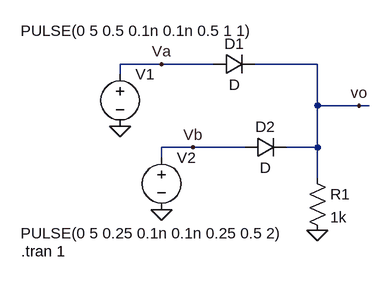
[diagram p0: schematic Draft17.asc]
Draft17.asc, the LTspice schematic file:
Version 4
SHEET 1 880 680
WIRE 144 64 80 64
WIRE 224 64 144 64
WIRE 384 64 288 64
WIRE 80 80 80 64
WIRE 384 128 384 64
WIRE 448 128 384 128
WIRE 464 128 448 128
WIRE 192 192 144 192
WIRE 272 192 192 192
WIRE 384 192 384 128
WIRE 384 192 336 192
WIRE 144 208 144 192
WIRE 384 240 384 192
FLAG 80 160 0
FLAG 144 288 0
FLAG 448 128 vo
FLAG 384 320 0
FLAG 144 64 Va
FLAG 192 192 Vb
SYMBOL voltage 80 64 R0
WINDOW 3 -153 -51 Left 2
WINDOW 123 0 0 Left 0
WINDOW 39 0 0 Left 0
SYMATTR InstName V1
SYMATTR Value PULSE(0 5 0.5 0.1n 0.1n 0.5 1 1)
SYMBOL voltage 144 192 R0
WINDOW 3 -217 132 Left 2
WINDOW 123 0 0 Left 0
WINDOW 39 0 0 Left 0
SYMATTR InstName V2
SYMATTR Value PULSE(0 5 0.25 0.1n 0.1n 0.25 0.5 2)
SYMBOL diode 224 80 R270
WINDOW 0 32 32 VTop 2
WINDOW 3 0 32 VBottom 2
SYMATTR InstName D1
SYMBOL diode 272 208 R270
WINDOW 0 32 32 VTop 2
WINDOW 3 0 32 VBottom 2
SYMATTR InstName D2
SYMBOL res 368 224 R0
SYMATTR InstName R1
SYMATTR Value 1k
TEXT -72 352 Left 2 !.tran 1

The netlist it stands for:
* Draft17.asc
V1 Va 0 PULSE(0 5 0.5 0.1n 0.1n 0.5 1 1)
V2 Vb 0 PULSE(0 5 0.25 0.1n 0.1n 0.25 0.5 2)
D1 Va vo D
D2 Vb vo D
R1 vo 0 1k
.model D D
.lib standard.dio
.tran 1
.backanno
.end